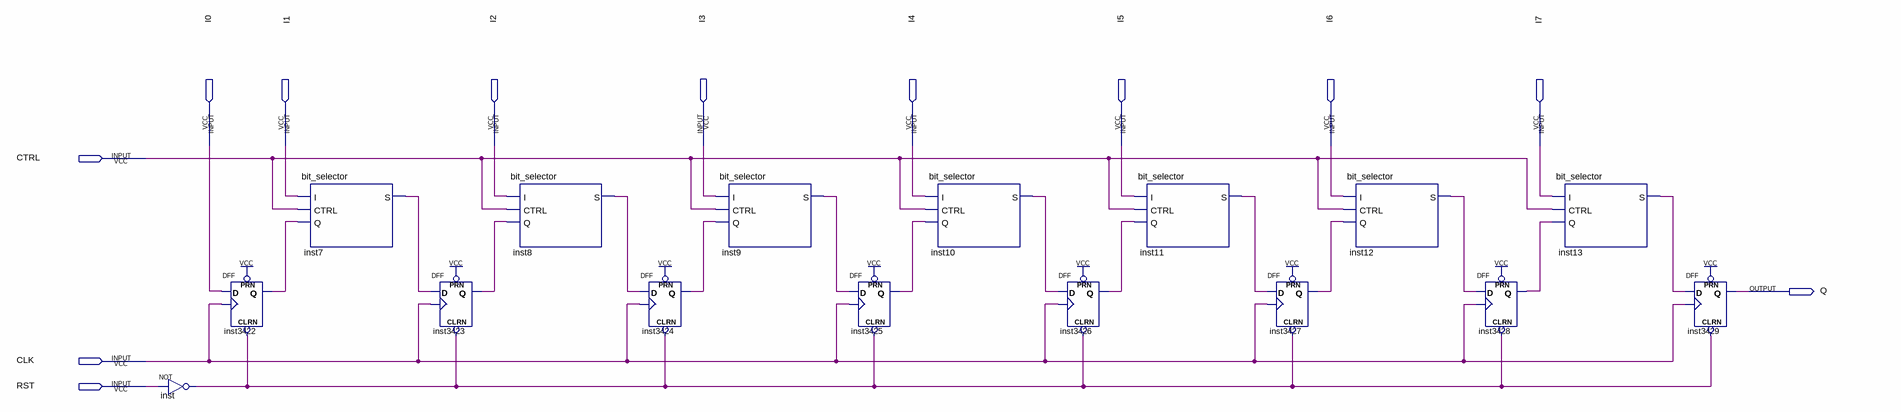
[diagram p0: schematic sheet]
// Quartus schematic PISO_8bits.bdf as structural Verilog: 16 symbols, 12 pins
module PISO_8bits (
  input  I0,
  input  I1,
  input  I2,
  input  I3,
  input  I4,
  input  I5,
  input  I6,
  input  I7,
  input  CTRL,
  input  CLK,
  input  RST,
  output Q
);

  wire inst7_s, inst8_s, inst9_s, inst10_s, inst11_s, inst12_s, inst13_s, inst3422_q, inst3423_q, inst3424_q,
       inst3425_q, inst3426_q, inst3427_q, inst3428_q, inst_out;

  not inst (inst_out, RST);
  DFF inst3422 (.CLRN(inst_out), .CLK(CLK), .D(I0), .PRN(1'b1), .Q(inst3422_q));
  bit_selector inst7 (.I(I1), .CTRL(CTRL), .Q(inst3422_q), .S(inst7_s));
  DFF inst3423 (.CLRN(inst_out), .CLK(CLK), .D(inst7_s), .PRN(1'b1), .Q(inst3423_q));
  bit_selector inst8 (.I(I2), .CTRL(CTRL), .Q(inst3423_q), .S(inst8_s));
  DFF inst3424 (.CLRN(inst_out), .CLK(CLK), .D(inst8_s), .PRN(1'b1), .Q(inst3424_q));
  bit_selector inst9 (.I(I3), .CTRL(CTRL), .Q(inst3424_q), .S(inst9_s));
  DFF inst3425 (.CLRN(inst_out), .CLK(CLK), .D(inst9_s), .PRN(1'b1), .Q(inst3425_q));
  bit_selector inst10 (.I(I4), .CTRL(CTRL), .Q(inst3425_q), .S(inst10_s));
  DFF inst3426 (.CLRN(inst_out), .CLK(CLK), .D(inst10_s), .PRN(1'b1), .Q(inst3426_q));
  bit_selector inst11 (.I(I5), .CTRL(CTRL), .Q(inst3426_q), .S(inst11_s));
  DFF inst3427 (.CLRN(inst_out), .CLK(CLK), .D(inst11_s), .PRN(1'b1), .Q(inst3427_q));
  bit_selector inst12 (.I(I6), .CTRL(CTRL), .Q(inst3427_q), .S(inst12_s));
  DFF inst3428 (.CLRN(inst_out), .CLK(CLK), .D(inst12_s), .PRN(1'b1), .Q(inst3428_q));
  bit_selector inst13 (.I(I7), .CTRL(CTRL), .Q(inst3428_q), .S(inst13_s));
  DFF inst3429 (.CLRN(inst_out), .CLK(CLK), .D(inst13_s), .PRN(1'b1), .Q(Q));
endmodule
